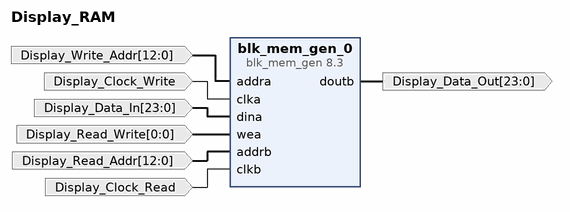
[diagram p0: block diagram of the top level]
# Vivado block design Display_RAM, xc7z020clg400-1, Vivado 2016.4
create_bd_design Display_RAM

create_bd_port -dir I -from 12 -to 0 Display_Write_Addr
create_bd_port -dir I Display_Clock_Write
create_bd_port -dir I -from 23 -to 0 Display_Data_In
create_bd_port -dir I -from 0 -to 0 Display_Read_Write
create_bd_port -dir I -from 12 -to 0 Display_Read_Addr
create_bd_port -dir I Display_Clock_Read
create_bd_port -dir O -from 23 -to 0 Display_Data_Out

create_bd_cell -type ip -vlnv xilinx.com:ip:blk_mem_gen:8.3 blk_mem_gen_0
set_property -dict [list \
  CONFIG.Memory_Type Simple_Dual_Port_RAM \
  CONFIG.Enable_32bit_Address false \
  CONFIG.Use_Byte_Write_Enable false \
  CONFIG.Write_Width_A 24 \
  CONFIG.Operating_Mode_A NO_CHANGE \
  CONFIG.Enable_A Always_Enabled \
  CONFIG.Write_Width_B 24 \
  CONFIG.Read_Width_B 24 \
  CONFIG.Enable_B Always_Enabled \
  CONFIG.Register_PortB_Output_of_Memory_Primitives true \
  CONFIG.Port_B_Clock 100 \
  CONFIG.Port_B_Enable_Rate 100 \
  CONFIG.use_bram_block Stand_Alone \
] [get_bd_cells blk_mem_gen_0]

# ---- connections ----

connect_bd_net -net addra_1 [get_bd_ports Display_Write_Addr] [get_bd_pins blk_mem_gen_0/addra]
connect_bd_net -net clka_1 [get_bd_ports Display_Clock_Write] [get_bd_pins blk_mem_gen_0/clka]
connect_bd_net -net dina_1 [get_bd_ports Display_Data_In] [get_bd_pins blk_mem_gen_0/dina]
connect_bd_net -net wea_1 [get_bd_ports Display_Read_Write] [get_bd_pins blk_mem_gen_0/wea]
connect_bd_net -net addrb_1 [get_bd_ports Display_Read_Addr] [get_bd_pins blk_mem_gen_0/addrb]
connect_bd_net -net clkb_1 [get_bd_ports Display_Clock_Read] [get_bd_pins blk_mem_gen_0/clkb]
connect_bd_net [get_bd_pins blk_mem_gen_0/doutb] [get_bd_ports Display_Data_Out]

validate_bd_design
save_bd_design
